# Altium project NewSmartwatch_V1_2025-02-18T12_48_20_UTC.PrjPcb
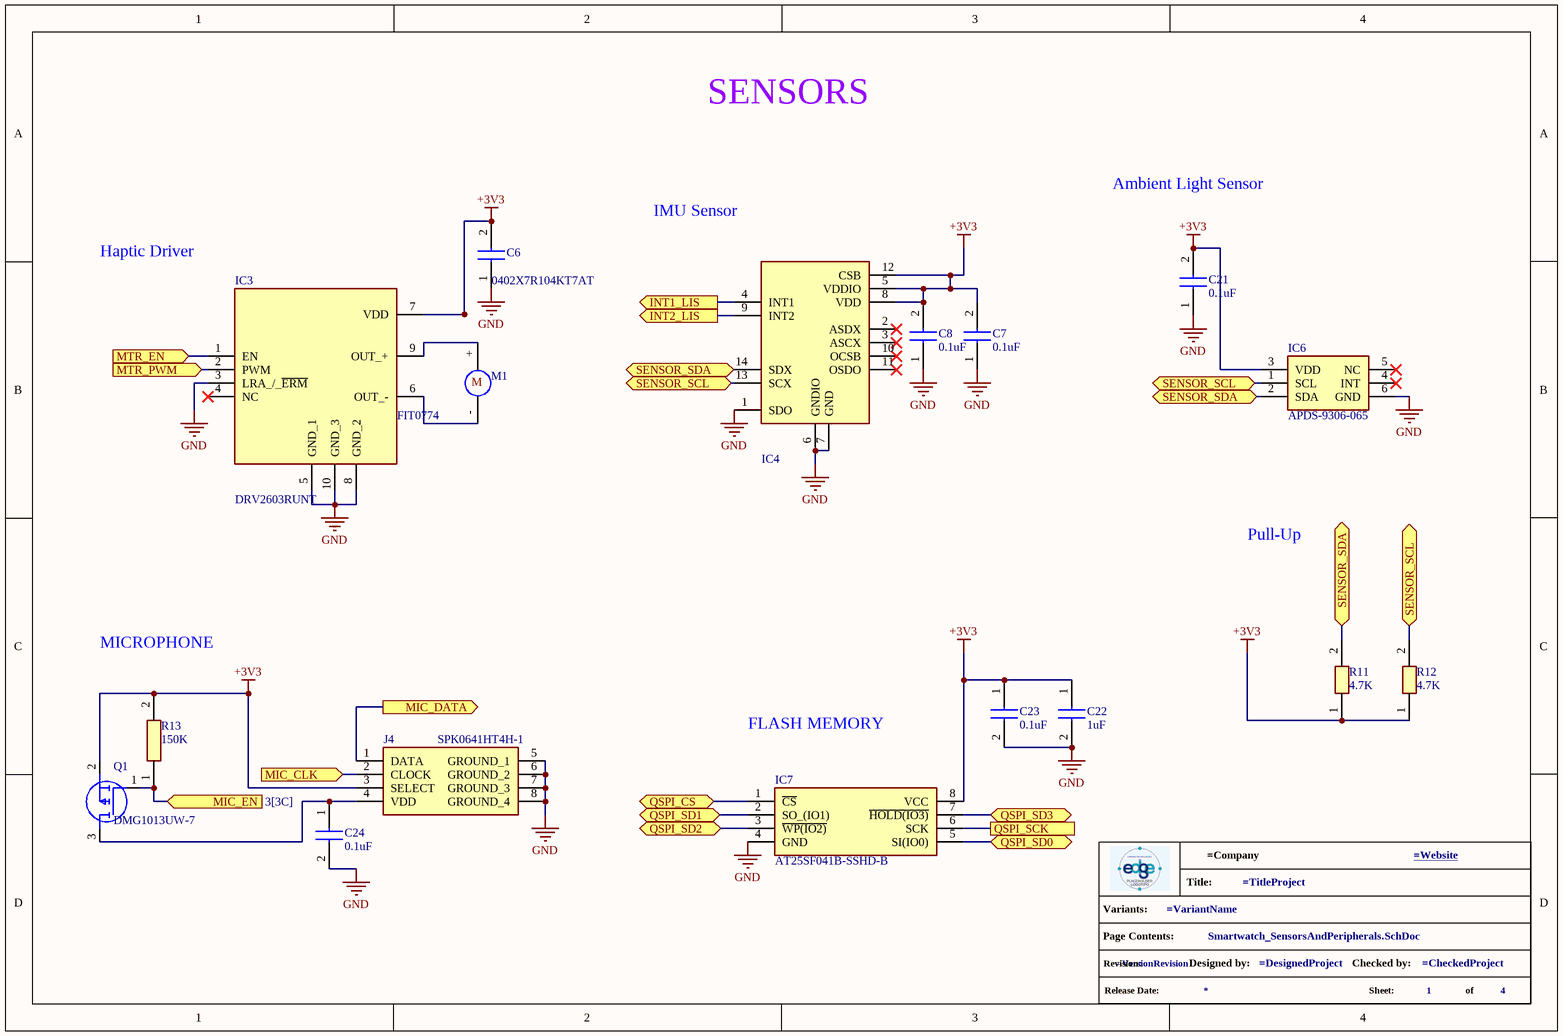
[diagram p0: Smartwatch_SensorsAndPeripherals.SchDoc]
4 sheets, 45 parts. Net scope: flat (ports and power ports of the same name join across sheets).
Board file: NewSmartwatch_V1.PcbDoc
Sheets:
  Smartwatch_SensorsAndPeripherals.SchDoc
  Smartwatch_PowerManagement.SchDoc
  Smartwatch_Microcontroller.SchDoc
  Smartwatch_Display.SchDoc

## Sheet Smartwatch_SensorsAndPeripherals.SchDoc
size A4; SheetNumber: 1; SheetTotal: 4

### Parts
(Parts that share a designator on the sheet are numbered #1, #2 ... from top to bottom, then left to right.)
*?#1  info_project  (value not drawn)  (graphical)
C6  0402X7R104KT7AT  [CAPC1005X61N]
C7  0.1uF  [CAPC1005X61N]
C8  0.1uF  [CAPC1005X61N]
C21  0.1uF  [CAPC1005X61N]
C22  1uF  [CAPC1005X65N]
C23  0.1uF  [CAPC1005X61N]
C24  0.1uF  [CAPC1005X61N]
IC3  DRV2603RUNT  [QFN50P200X200X80-10N-D]
IC4  BMI270  [BMI270]  (value not drawn)
IC6  APDS-9306-065  [APDS9306065]
IC7  AT25SF041B-SSHD-B  [SOIC127P600X175-8N]
J4  SPK0641HT4H-1  [SPK0641HT4H1]
M1  FIT0774  [FIT0774]
Q1  DMG1013UW-7  [SOT65P210X110-3N]
R11  4.7K  [ERJPA2_(0402)]
R12  4.7K  [ERJPA2_(0402)]
R13  150K  [RESC1608X55N]

### Ports
INT1_LIS (out, see 3[1C]), INT2_LIS (out, see 3[2D]), MIC_CLK (in, see 3[1D]), MIC_DATA (out, see 3[1C]), MIC_EN (in, see 3[3C]), MTR_EN (in, see 3[2C]), MTR_PWM (in, see 3[2C]), QSPI_CS (bidir, see 3[1C]), QSPI_SCK (see 3[1D]), QSPI_SD0 (bidir, see 3[1C]), QSPI_SD1 (bidir, see 3[1C]), QSPI_SD2 (bidir, see 3[1C]), QSPI_SD3 (bidir, see 3[1D]), SENSOR_SCL (bidir, see 1[2B], 1[3B], 3[1B]), SENSOR_SCL (bidir, see 1[2B], 1[4C], 3[1B]), SENSOR_SCL (bidir, see 1[3B], 1[4C], 3[1B]), SENSOR_SDA (bidir, see 1[2B], 1[3B], 3[1B]), SENSOR_SDA (bidir, see 1[2B], 1[4C], 3[1B]), SENSOR_SDA (bidir, see 1[3B], 1[4C], 3[1B])

### Nets
+3V3: C6.2 C7.2 C8.2 C21.2 C22.1 C23.1 IC3.7(VDD) IC4.5(VDDIO) IC4.8(VDD) IC4.12(CSB) IC6.3(VDD) IC7.8(VCC) J4.3(SELECT) Q1.2(S) R11.1 R12.1 R13.2
GND: C6.1 C7.1 C8.1 C21.1 C22.2 C23.2 C24.2 IC3.3(LRA_/_~{ERM}) IC3.5(GND_1) IC3.8(GND_2) IC3.10(GND_3) IC4.1(SDO) IC4.6(GNDIO) IC4.7(GND) IC6.6(GND) IC7.4(GND) J4.5(GROUND_1) J4.6(GROUND_2) J4.7(GROUND_3) J4.8(GROUND_4)
INT1_LIS: IC4.4(INT1) ; port INT1_LIS
INT2_LIS: IC4.9(INT2) ; port INT2_LIS
MIC_CLK: J4.2(CLOCK) ; port MIC_CLK
MIC_DATA: J4.1(DATA) ; port MIC_DATA
MIC_EN: Q1.1(G) R13.1 ; port MIC_EN
MTR_EN: IC3.1(EN) ; port MTR_EN
MTR_PWM: IC3.2(PWM) ; port MTR_PWM
QSPI_CS: IC7.1(~{CS}) ; port QSPI_CS
QSPI_SCK: IC7.6(SCK) ; port QSPI_SCK
QSPI_SD0: IC7.5(SI(IO0)) ; port QSPI_SD0
QSPI_SD1: IC7.2(SO_(IO1)) ; port QSPI_SD1
QSPI_SD2: IC7.3(~{WP(IO2)}) ; port QSPI_SD2
QSPI_SD3: IC7.7(~{HOLD(IO3)}) ; port QSPI_SD3
SENSOR_SCL: IC4.13(SCX) IC6.1(SCL) R12.2 ; port SENSOR_SCL
SENSOR_SDA: IC4.14(SDX) IC6.2(SDA) R11.2 ; port SENSOR_SDA
NetC24_1: C24.1 J4.4(VDD) Q1.3(D)
NetIC3_6: IC3.6(OUT_-) M1.-
NetIC3_9: IC3.9(OUT_+) M1.+

Not connected (* = marked no-connect by the designer): IC3 4(NC)*; IC4 2(ASDX)* 3(ASCX)* 10(OCSB)* 11(OSDO)*; IC6 4(INT)* 5(NC)*

### Notes on the sheet
- SENSORS
- IMU Sensor
- Ambient Light Sensor
- Haptic Driver
- Pull-Up
- MICROPHONE
- FLASH MEMORY
- (in symbol FIT0774) M
- (in symbol info_project) Title:; Variants:; Page Contents:; Revision:; Designed by:; Checked by:; Release Date:; Sheet:; of

### Library data of the parts
C6-C8 C21 C23 C24 = 0402X7R104KT7AT: Multilayer Ceramic Capacitors MLCC - SMD/SMT 16V 0.1uF X7R 10%; Manufacturer_Name: Kyocera AVX; Datasheet Link: https://www.mouser.es/datasheet/2/40/general_purpose-3169586.pdf; Height: 0.61mm; Manufacturer_Part_Number: 0402X7R104KT7AT; Mouser Part Number: 581-0402X7R104KT7AT; Mouser Price/Stock: https://www.mouser.co.uk/ProductDetail/KYOCERA-AVX/0402X7R104KT7AT?qs=DPoM0jnrROXD467pFR2ukA%3D%3D
C22 = CC0402KRX5R6BB105: Multilayer Ceramic Capacitors MLCC - SMD/SMT 10V 1uF X5R 0402 10% HI CV; Manufacturer_Name: YAGEO; Datasheet Link: https://www.yageo.com/upload/media/product/app/datasheet/mlcc/upy-gphc_x5r_4v-to-50v.pdf; Height: 0.55mm; Manufacturer_Part_Number: CC0402KRX5R6BB105; Mouser Part Number: 603-CC402KRX5R6BB105; Mouser Price/Stock: https://www.mouser.co.uk/ProductDetail/YAGEO/CC0402KRX5R6BB105?qs=BKNoF%2F0xMNu0TvpE6ze2Iw%3D%3D; Arrow Part Number: CC0402KRX5R6BB105; Arrow Price/Stock: https://www.arrow.com/en/products/cc0402krx5r6bb105/yageo?region=nac
IC3 = DRV2603RUNT: Motor / Motion / Ignition Controllers & Drivers Haptic Driver w/Auto Resonance Tracking; Manufacturer_Name: Texas Instruments; Datasheet Link: http://www.ti.com/lit/ds/symlink/drv2603.pdf; Height: 0.8mm; Manufacturer_Part_Number: DRV2603RUNT; Mouser Part Number: 595-DRV2603RUNT; Mouser Price/Stock: https://www.mouser.co.uk/ProductDetail/Texas-Instruments/DRV2603RUNT?qs=y0LsnOHuQQ66fXxKAgGo4A%3D%3D; Arrow Part Number: DRV2603RUNT; Arrow Price/Stock: https://www.arrow.com/en/products/drv2603runt/texas-instruments
IC4 = BMI270: IMUs - Inertial Measurement Units Smart Ultra-Low Power Inertial Measurement Unit (IMU) for Wearable Applications; Manufacturer_Name: BOSCH; Datasheet Link: https://www.bosch-sensortec.com/media/boschsensortec/downloads/datasheets/bst-bmi270-ds000.pdf; Height: 0.87mm; Manufacturer_Part_Number: BMI270; Mouser Part Number: 262-BMI270; Mouser Price/Stock: https://www.mouser.co.uk/ProductDetail/Bosch-Sensortec/BMI270?qs=u16ybLDytRYIj%252BjQEee88A%3D%3D; Arrow Part Number: BMI270; Arrow Price/Stock: https://www.arrow.com/en/products/bmi270/bosch?utm_currency=USD&region=nac
IC6 = APDS-9306-065: Ambient Light Sensors Digital Ambient Light Sensor; Manufacturer_Name: Avago Technologies; Datasheet Link: A19870331a; Height: 0.75mm; Manufacturer_Part_Number: APDS-9306-065; Mouser Part Number: 630-APDS-9306-065; Mouser Price/Stock: https://www.mouser.co.uk/ProductDetail/Broadcom-Avago/APDS-9306-065?qs=JUmsgfbaopRTut8Cx4p19A%3D%3D
IC7 = AT25SF041B-SSHD-B: NOR Flash 4 Mbit, 3.0V (2.5V to 3.6V), -40C to 85C, SOIC-N 150mil (Tube), Single, Dual, Quad SPI NOR Flash; Manufacturer_Name: Renesas Electronics; Datasheet Link: https://www.mouser.in/datasheet/2/698/REN_DS_AT25SF041B_190H_062022_DST_20220603_1-3076039.pdf; Height: 1.75mm; Manufacturer_Part_Number: AT25SF041B-SSHD-B; Mouser Part Number: 988-AT25SF041BSSHDB; Mouser Price/Stock: https://www.mouser.co.uk/ProductDetail/Renesas-Dialog/AT25SF041B-SSHD-B?qs=IS%252B4QmGtzzoAv7Cb4U2tFA%3D%3D
J4 = SPK0641HT4H-1: Microfones MEMS SISONIC MEMS MICROPHONE;Digital;Top;64.5dB SNR;120dB SPL;-26 +/-1dBV;35Hz;70dB PSRR;Low Power: 230 / Standard: 630;1.8V; Manufacturer_Name: Knowles Johanson Manufacturing; Datasheet Link: https://www.knowles.com/docs/default-source/model-downloads/spk0641ht4h-1-rev-a.pdf; Height: 1.1mm; Manufacturer_Part_Number: SPK0641HT4H-1; Mouser Part Number: 721-SPK0641HT4H-1; Mouser Price/Stock: https://www.mouser.com/Search/Refine.aspx?Keyword=721-SPK0641HT4H-1
M1 = FIT0774: Mini Vibration Motor (10*2.7MM); Manufacturer: DFRobot; Supplier: Mouser; Supplier Part Number: 426-FIT0774; Manufacturer Part Number: FIT0774; RoHS: No; Category: Motors and Drives; Stock: 3316; Pricing: 1=0,99, 10=0,99, 50=0,99, 100=0,99, 1000=0,99, 10000=0,99 (USD)
Q1 = DMG1013UW-7: MOSFET (P-Channel); Manufacturer_Name: Diodes Incorporated; Datasheet Link: https://www.diodes.com//assets/Datasheets/ds31861.pdf; Height: 1.1mm; Manufacturer_Part_Number: DMG1013UW-7; Mouser Part Number: 621-DMG1013UW-7; Mouser Price/Stock: https://www.mouser.co.uk/ProductDetail/Diodes-Incorporated/DMG1013UW-7?qs=GWgl%252BsiMZr9p7lJcuAyJvw%3D%3D; Arrow Part Number: DMG1013UW-7; Arrow Price/Stock: https://www.arrow.com/en/products/dmg1013uw-7/diodes-incorporated?region=nac
R11 R12 = ERJ-PA2F4701X: Thick Film Resistors - SMD 0402 1% 4.7Kohm Anti-Surge AEC-Q200; Manufacturer_Name: Panasonic; Datasheet Link: http://industrial.panasonic.com/cdbs/www-data/pdf/RDO0000/AOA0000C331.pdf; Height: 0.4mm; Manufacturer_Part_Number: ERJ-PA2F4701X; Mouser Part Number: 667-ERJ-PA2F4701X; Mouser Price/Stock: https://www.mouser.co.uk/ProductDetail/Panasonic/ERJ-PA2F4701X?qs=h9NfwcE6J0JdNXujYyUhOg%3D%3D; Arrow Part Number: ERJ-PA2F4701X; Arrow Price/Stock: https://www.arrow.com/en/products/erj-pa2f4701x/panasonic?region=nac
R13 = RK73B1JTTDD154J: Thick Film Resistors - SMD 1/10W 150K OHM 5%; Manufacturer_Name: KOA Speer; Datasheet Link: http://www.koaspeer.com/catimages/Products/RK73-RT/RK73-RT.pdf; Height: 0.55mm; Manufacturer_Part_Number: RK73B1JTTDD154J; Mouser Part Number: 660-RK73B1JTTDD154J; Mouser Price/Stock: https://www.mouser.co.uk/ProductDetail/KOA-Speer/RK73B1JTTDD154J?qs=eQc%252BYniTHCffTX8fUgD2hw%3D%3D

## Sheet Smartwatch_PowerManagement.SchDoc
size A4; SheetNumber: 2; SheetTotal: 4
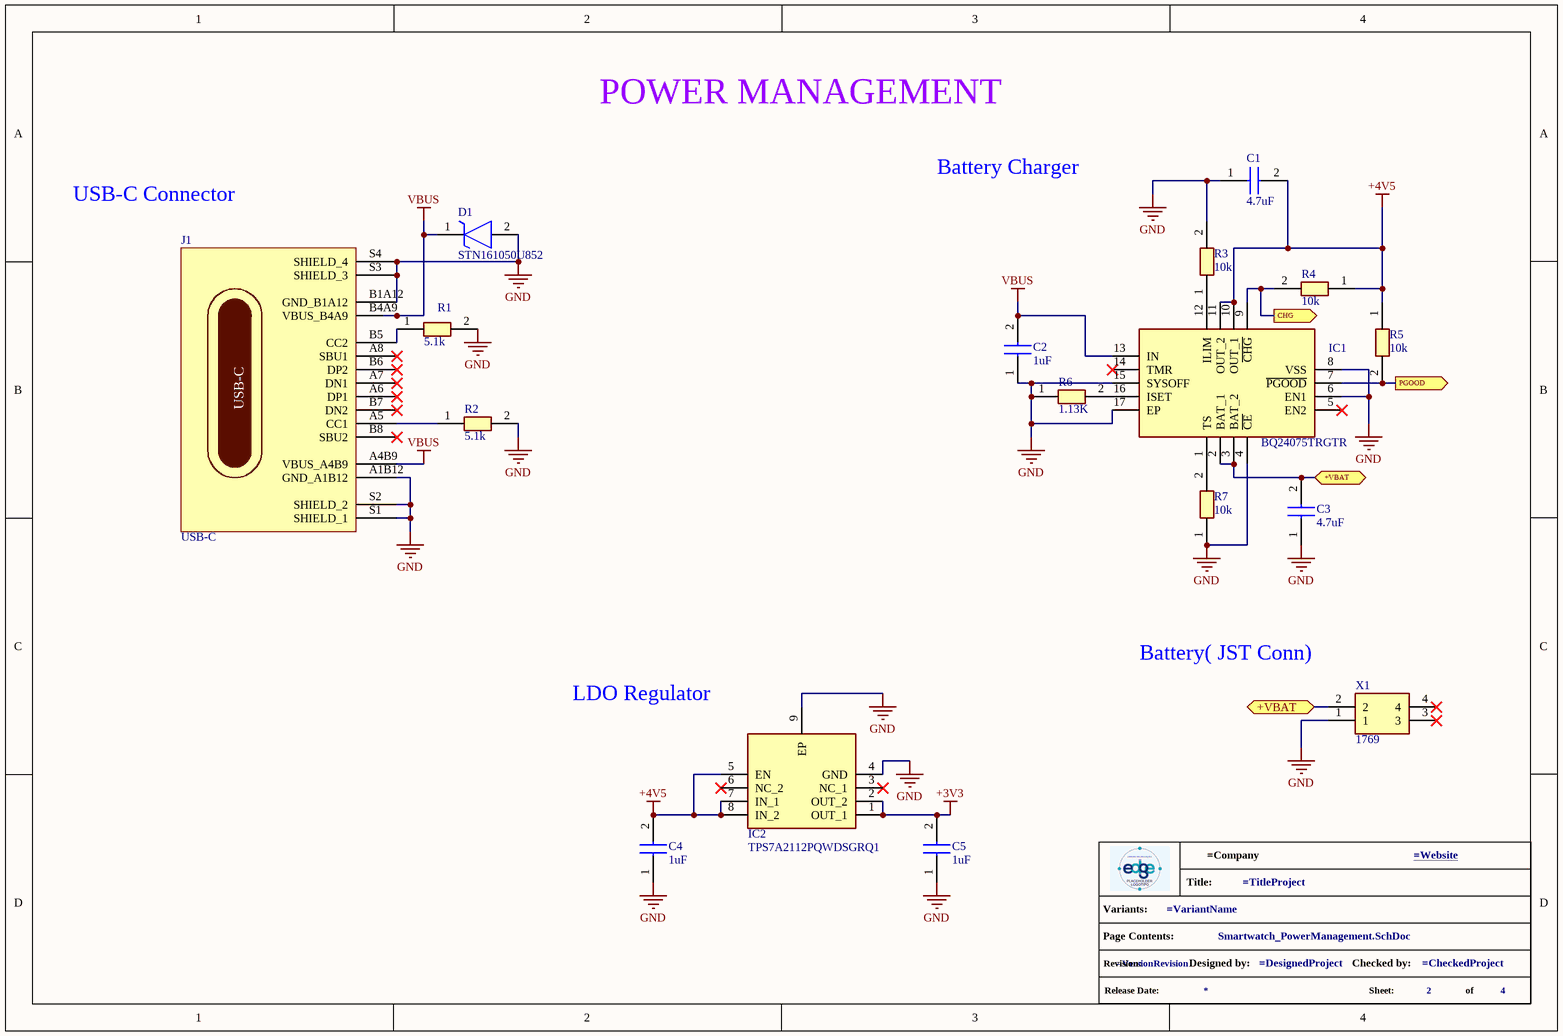
[diagram p1: Smartwatch_PowerManagement.SchDoc]

### Parts
(Parts that share a designator on the sheet are numbered #1, #2 ... from top to bottom, then left to right.)
*?#2  info_project  (value not drawn)  (graphical)
C1  4.7uF  [CAPC1005X65N]
C2  1uF  [CAPC1005X65N]
C3  4.7uF  [CAPC1005X65N]
C4  1uF  [CAPC1005X65N]
C5  1uF  [CAPC1005X65N]
D1  STN161050U852  [STN161050U852]
IC1  BQ24075TRGTR  [QFN50P300X300X100-17N-D]
IC2  TPS7A2112PQWDSGRQ1  [SON50P200X200X80-9N]
J1  USB-C  [FP-2171790001-MFG]
R1  5.1k  [RESC1005X40]
R2  5.1k  [RESC1005X40]
R3  10k  [RESC1005X37N]
R4  10k  [RESC1005X37N]
R5  10k  [RESC1005X37N]
R6  1.13K  [RESC1005X37N]
R7  10k  [RESC1005X37N]
X1  1769  [1769]

### Ports
+VBAT (bidir, see 2[4B]), +VBAT (bidir, see 2[4C]), CHG (out, see 3[1C]), PGOOD (out, see 3[1C])

### Nets
+3V3: C5.2 IC2.1(OUT_1) IC2.2(OUT_2)
+4V5: C1.2 C4.2 IC1.10(OUT_1) IC1.11(OUT_2) IC2.5(EN) IC2.7(IN_1) IC2.8(IN_2) R4.1 R5.1
GND: C1.1 C2.1 C3.1 C4.1 C5.1 D1.2(A) IC1.4(~{CE}) IC1.6(EN1) IC1.8(VSS) IC1.15(SYSOFF) IC1.17(EP) IC2.4(GND) IC2.9(EP) J1.A1B12(GND_A1B12) J1.B1A12(GND_B1A12) J1.S1(SHIELD_1) J1.S2(SHIELD_2) J1.S3(SHIELD_3) J1.S4(SHIELD_4) R1.2 R2.2 R3.2 R6.1 R7.1 X1.1
VBUS: C2.2 D1.1(K) IC1.13(IN) J1.A4B9(VBUS_A4B9) J1.B4A9(VBUS_B4A9)
+VBAT: C3.2 IC1.2(BAT_1) IC1.3(BAT_2) X1.2 ; port +VBAT
CHG: IC1.9(~{CHG}) R4.2 ; port CHG
PGOOD: IC1.7(~{PGOOD}) R5.2 ; port PGOOD
NetIC1_1: IC1.1(TS) R7.2
NetIC1_12: IC1.12(ILIM) R3.1
NetIC1_16: IC1.16(ISET) R6.2
NetJ1_A5: J1.A5(CC1) R2.1
NetJ1_B5: J1.B5(CC2) R1.1

Not connected (* = marked no-connect by the designer): IC1 5(EN2)* 14(TMR)*; IC2 3(NC_1)* 6(NC_2)*; J1 A6(DP1)* A7(DN1)* A8(SBU1)* B6(DP2)* B7(DN2)* B8(SBU2)*; X1 3* 4*

### Notes on the sheet
- POWER MANAGEMENT
- Battery Charger
- USB-C Connector
- (near IC2) LDO Regulator
- (near X1) Battery( JST Conn)
- (in symbol info_project) Title:; Variants:; Page Contents:; Revision:; Designed by:; Checked by:; Release Date:; Sheet:; of

### Library data of the parts
C1 C3 = GRM31CR61A475KA01L: Multilayer Ceramic Capacitors MLCC - SMD/SMT 4.7 uF 10 VDC 20% 0402 X5R; Manufacturer_Name: Murata Electronics; Datasheet Link: http://www.murata.com/~/media/webrenewal/support/library/catalog/products/capacitor/mlcc/c02e.pdf; Height: 1.8mm; Manufacturer_Part_Number: GRM31CR61A475KA01L; Mouser Part Number: 81-GRM426R475K10L; Mouser Price/Stock: https://www.mouser.co.uk/ProductDetail/Murata-Electronics/GRM31CR61A475KA01L?qs=v6FXEKp3YeVDfOIVbbYCqg%3D%3D; Arrow Part Number: GRM31CR61A475KA01L; Arrow Price/Stock: https://www.arrow.com/en/products/grm31cr61a475ka01l/murata-manufacturing
C2 C4 C5 = CC0402KRX5R6BB105: as C22 on sheet Smartwatch_SensorsAndPeripherals; Datasheet Link: https://www.yageo.com/upload/media/product/app/datasheet/mlcc/upy-gphc_x5r_4v-to-50v.pdf; Height: 0.55mm; Manufacturer_Part_Number: CC0402KRX5R6BB105; Mouser Part Number: 603-CC402KRX5R6BB105; Mouser Price/Stock: https://www.mouser.co.uk/ProductDetail/YAGEO/CC0402KRX5R6BB105?qs=BKNoF%2F0xMNu0TvpE6ze2Iw%3D%3D; Arrow Part Number: CC0402KRX5R6BB105; Arrow Price/Stock: https://www.arrow.com/en/products/cc0402krx5r6bb105/yageo?region=nac
D1 = STN161050U852: TVS Diode (Uni-directional); Manufacturer_Name: Eaton; Datasheet Link: https://www.digikey.com/en/products/detail/eaton-electronics-division/STN161050U852/13280470?msockid=3e3afa68a50969ca3057ef1ca4c9684b; Height: 0.55mm; Manufacturer_Part_Number: STN161050U852; Mouser Part Number: 504-STN161050U852; Mouser Price/Stock: https://www.mouser.co.uk/ProductDetail/Bussmann-Eaton/STN161050U852?qs=DPoM0jnrROX%2FlbVCTeWaTw%3D%3D
IC1 = BQ24075TRGTR: Gerenciadores de bateria 1.5A USB-Friendly Li Ion Batt Charger; Manufacturer_Name: Texas Instruments; Datasheet Link: http://componentsearchengine.com/Datasheets/1/BQ24075TRGTR.pdf; Height: 1mm; Manufacturer_Part_Number: BQ24075TRGTR; Mouser Part Number: 595-BQ24075TRGTR; Mouser Price/Stock: https://www.mouser.co.uk/ProductDetail/Texas-Instruments/BQ24075TRGTR?qs=%2Fqzd9s%252BcLd4uxZAT5jNskQ%3D%3D; Arrow Part Number: BQ24075TRGTR; Arrow Price/Stock: https://www.arrow.com/en/products/bq24075trgtr/texas-instruments?region=nac
IC2 = TPS7A2112PQWDSGRQ1: LDO Voltage Regulators Automotive, 500mA, low-noise ultra-low-IQ high-PSRR low-dropout (LDO) voltage regulator; Manufacturer_Name: Texas Instruments; Datasheet Link: https://www.ti.com/lit/gpn/tps7a21-q1; Height: 0.8mm; Manufacturer_Part_Number: TPS7A2112PQWDSGRQ1
J1 = 217179-0001: USB Connector, 16 Contact(s), Female, Right Angle, Surface Mount Terminal, Locking, Receptacle; Manufacturer: Molex; Supplier: Mouser; Supplier Part Number: 538-217179-0001; Manufacturer Part Number: 217179-0001; RoHS: No; Category: USB Connectors; Stock: 4841; Pricing: 1=0,9, 10=0,745, 50=0,745, 100=0,622, 1000=0,622, 10000=0,446 (USD)
R1 R2 = ERJ-2RHD512X: Fixed Resistor, Metal Glaze/thick Film, 0.063W, 5110ohm, 50V, 0.5% +/-Tol, 50ppm/Cel, Surface Mount, 0402; Manufacturer: Panasonic; Manufacturer Series: ERJ2R; Power: 63mW; Rated Temperature: 70°C; Value: 5.11kR; Temperature Coefficient: 50ppm/°C; Supplier: Mouser; Supplier Part Number: 667-ERJ-2RHD512X; Manufacturer Part Number: ERJ-2RHD512X; RoHS: Yes; Stock: 18329; Pricing: 1=0,13, 10=0,11, 50=0,11, 100=0,043, 1000=0,019, 10000=0,019 (USD); Mounting Technology: Surface Mount; Pins: 2; Package Shape: Rectangular; Case/Package: 0402; Terminal Finish: Tin; Min Operating Temperature: -55°C; Max Operating Temperature: 125°C; Tolerance: 0.5%; JESD-609 Code: e3; Resistor Type: FIXED RESISTOR; Packaging: Tape and Reel; Technology: METAL GLAZE/THICK FILM; Termination: Wraparound; Working Voltage: 50V; Reach SVHC Compliant: Yes; RoHS Compliant: Yes; ComponentLink1URL: https://datasheet.ciiva.com:443/pdfs/VipMasterCap/Capacitor/PANA/PANAS11022/PANAS11022-1.pdf?src-supplier=IHS+Markit; ComponentLink1Description: https://datasheet.ciiva.com:443/pdfs/VipMasterCap/Capacitor/PANA/PANAS11022/PANAS11022-1.pdf?src-supplier=IHS+Markit; ComponentLink2URL: https://datasheet.ciiva.com/24037/aoa0000ce2-24037669.pdf?src-supplier=Mouser; ComponentLink2Description: https://datasheet.ciiva.com/24037/aoa0000ce2-24037669.pdf?src-supplier=Mouser
R3-R5 R7 = MCS0402MD1002BE100: Resistores de Filme Fino - SMD .063W 10Kohms 0.1% 0402 25ppm Auto; Manufacturer_Name: Vishay; Datasheet Link: http://www.vishay.com/docs/28705/mcx0x0xpro.pdf; Height: 0.37mm; Manufacturer_Part_Number: MCS0402MD1002BE100; Mouser Part Number: 594-MCS0402MD1002BE1; Mouser Price/Stock: https://www.mouser.co.uk/ProductDetail/Vishay-Beyschlag/MCS0402MD1002BE100?qs=3SvaY9RawMIFge2HspqWnA%3D%3D; Arrow Part Number: MCS0402MD1002BE100; Arrow Price/Stock: https://www.arrow.com/en/products/mcs0402md1002be100/vishay?region=nac
R6 = AF0402FR-071K13L: Fixed Resistor, Metal Glaze/thick Film, 0.0625W, 1130ohm, 50V, 1% +/-Tol, 100ppm/Cel, Surface Mount, 0402; Manufacturer: Yageo; Additional Feature: ANTI-SULFUR; Power: 62.5mW; Rated Temperature: 70°C; Value: 1.13kR; Temperature Coefficient: 100ppm/°C; Package Height: 0.32mm; Package Length: 1mm; Package Width: 0.5mm; Reference Standard: AEC-Q200; Supplier: Mouser; Supplier Part Number: 603-AF0402FR-071K13L; Manufacturer Part Number: AF0402FR-071K13L; RoHS: Yes; Category: Chip SMD Resistors; Stock: 3100; Pricing: 1=0,15, 10=0,037, 50=0,037, 100=0,02, 1000=0,012, 10000=0,006 (USD); Mounting Technology: Surface Mount; Pins: 2; Case/Package: 0402; Min Operating Temperature: -55°C; Max Operating Temperature: 155°C; Tolerance: 1%; Resistor Type: FIXED RESISTOR; Construction: Rectangular; Package Style: SMTMeter; Packaging: Tape and Reel; Termination: Wraparound; Working Voltage: 50V; Reach SVHC Compliant: Yes; RoHS Compliant: Yes; ComponentLink1URL: https://datasheet.ciiva.com:443/pdfs/VipMasterIC/IC/YAGO/YAGO-S-A0009016998/YAGO-S-A0009016998-1.pdf?src-supplier=IHS+Markit; ComponentLink1Description: https://datasheet.ciiva.com:443/pdfs/VipMasterIC/IC/YAGO/YAGO-S-A0009016998/YAGO-S-A0009016998-1.pdf?src-supplier=IHS+Markit; ComponentLink2URL: https://www.yageo.com/upload/media/product/productsearch/datasheet/rchip/PYu-AF_51_RoHS_L_6.pdf?src-supplier=Digikey; ComponentLink2Description: https://www.yageo.com/upload/media/product/productsearch/datasheet/rchip/PYu-AF_51_RoHS_L_6.pdf?src-supplier=Digikey
X1 = 1769: Adafruit Accessories JST-PH 2-pin SMT Right Angle Connect; Datasheet Link: https://cdn-shop.adafruit.com/datasheets/17311.pdf; Height: 5.5mm; Manufacturer_Name: Adafruit; Manufacturer_Part_Number: 1769; Mouser Part Number: 485-1769; Mouser Price/Stock: https://www.mouser.co.uk/ProductDetail/Adafruit/1769?qs=GURawfaeGuBbgoGtf2XstA%3D%3D; Arrow Part Number: 1769; Arrow Price/Stock: https://www.arrow.com/en/products/1769/adafruit-industries?utm_currency=USD&region=nac

## Sheet Smartwatch_Microcontroller.SchDoc
size A4; SheetNumber: 3; SheetTotal: 4
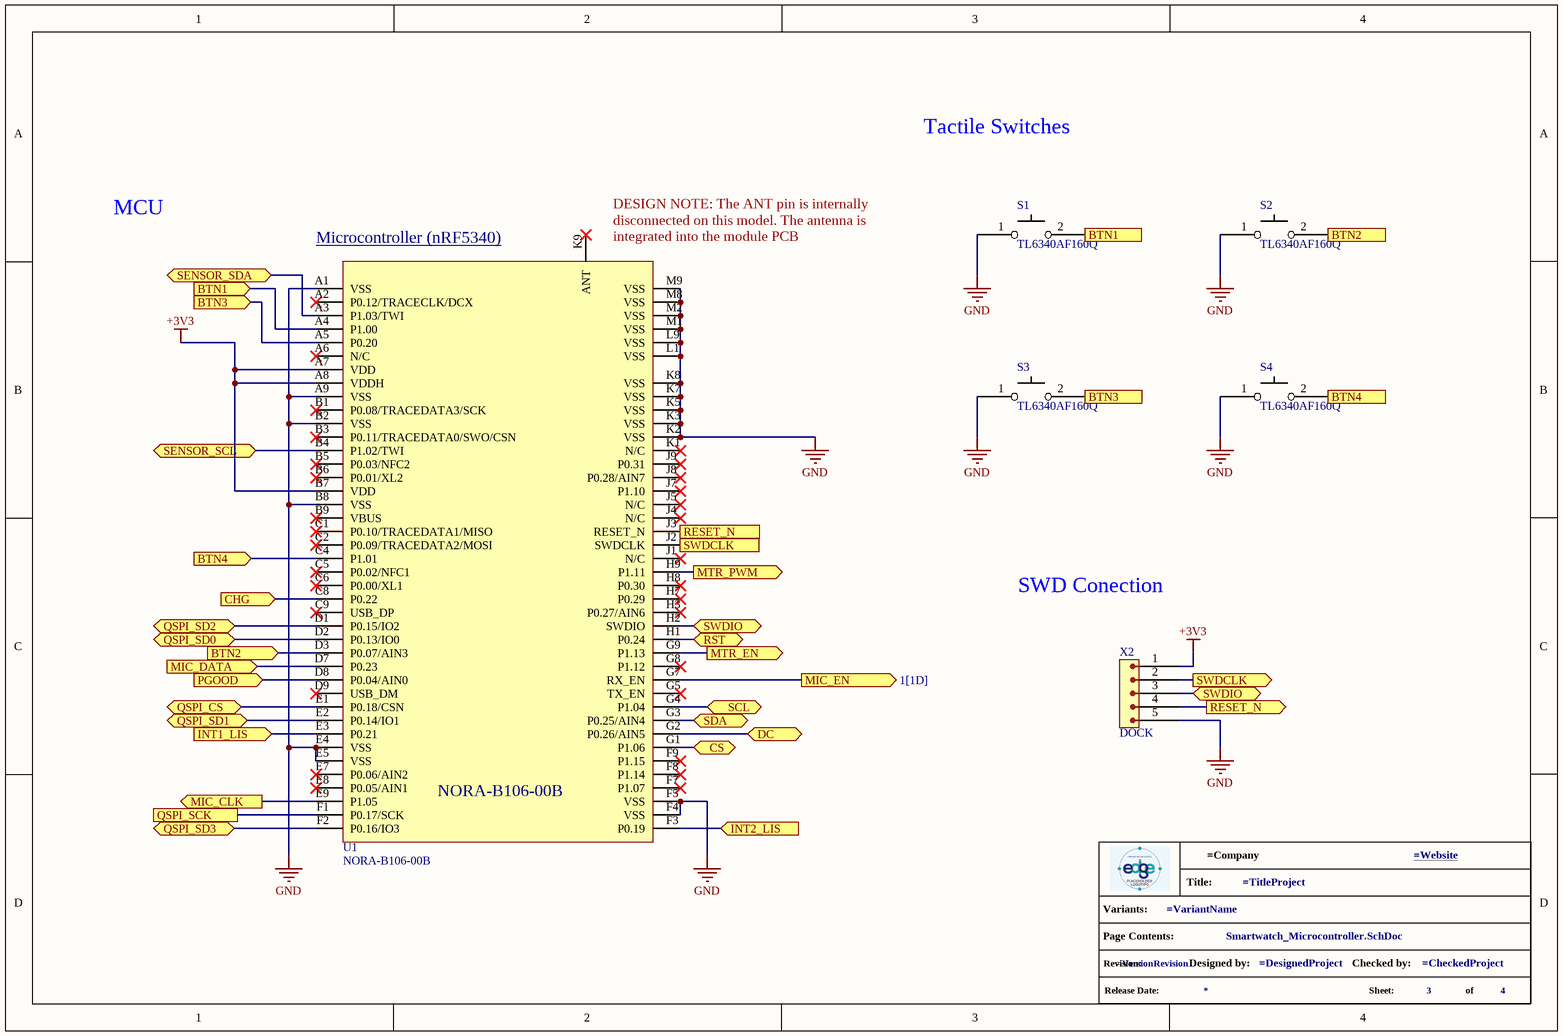
[diagram p2: Smartwatch_Microcontroller.SchDoc]

### Parts
(Parts that share a designator on the sheet are numbered #1, #2 ... from top to bottom, then left to right.)
*?#3  info_project  (value not drawn)  (graphical)
S1  TL6340AF160Q  [SW_TL6340AF160Q]
S2  TL6340AF160Q  [SW_TL6340AF160Q]
S3  TL6340AF160Q  [SW_TL6340AF160Q]
S4  TL6340AF160Q  [SW_TL6340AF160Q]
U1  NORA-B106-00B  [XCVR_NORA-B106-00B]
X2  DOCK  [SAMTEC_FTSH-105-XX-X-DV]

### Ports
BTN1 (in, see 3[3A]), BTN1 (out, see 3[1B]), BTN2 (in, see 3[4A]), BTN2 (out, see 3[1C]), BTN3 (in, see 3[3B]), BTN3 (out, see 3[1B]), BTN4 (in, see 3[4B]), BTN4 (out, see 3[1C]), CHG (in, see 2[4B]), CS (bidir, see 4[1B]), DC (bidir, see 4[1B]), INT1_LIS (in, see 1[2B]), INT2_LIS (in, see 1[2B]), MIC_CLK (out, see 1[1D]), MIC_DATA (in, see 1[1C]), MIC_EN (out, see 1[1D]), MTR_EN (out, see 1[1B]), MTR_PWM (out, see 1[1B]), PGOOD (in, see 2[4B]), QSPI_CS (bidir, see 1[2D]), QSPI_SCK (see 1[3D]), QSPI_SD0 (bidir, see 1[3D]), QSPI_SD1 (bidir, see 1[2D]), QSPI_SD2 (bidir, see 1[2D]), QSPI_SD3 (bidir, see 1[3D]), RESET_N (in, see 3[4C]), RESET_N (out, see 3[2C]), RST (bidir, see 4[1B]), SCL (bidir, see 4[1B]), SDA (bidir, see 4[1B]), SENSOR_SCL (bidir, see 1[2B], 1[3B], 1[4C]), SENSOR_SDA (bidir, see 1[2B], 1[3B], 1[4C]), SWDCLK (in, see 3[4C]), SWDCLK (out, see 3[2C]), SWDIO (bidir, see 3[2C]), SWDIO (bidir, see 3[4C])

### Nets
+3V3: U1.A7(VDD) U1.A8(VDDH) U1.B7(VDD) X2.1
GND: S1.1 S2.1 S3.1 S4.1 U1.A1(VSS) U1.A9(VSS) U1.B2(VSS) U1.B8(VSS) U1.E4(VSS) U1.E5(VSS) U1.F4(VSS) U1.F5(VSS) U1.K2(VSS) U1.K3(VSS) U1.K5(VSS) U1.K7(VSS) U1.K8(VSS) U1.L1(VSS) U1.L9(VSS) U1.M1(VSS) U1.M2(VSS) U1.M8(VSS) U1.M9(VSS) X2.5
BTN1: S1.2 U1.A4(P1.00) ; port BTN1
BTN2: S2.2 U1.D3(P0.07/AIN3) ; port BTN2
BTN3: S3.2 U1.A5(P0.20) ; port BTN3
BTN4: S4.2 U1.C4(P1.01) ; port BTN4
CHG: U1.C8(P0.22) ; port CHG
CS: U1.G1(P1.06) ; port CS
DC: U1.G2(P0.26/AIN5) ; port DC
INT1_LIS: U1.E3(P0.21) ; port INT1_LIS
INT2_LIS: U1.F3(P0.19) ; port INT2_LIS
MIC_CLK: U1.E9(P1.05) ; port MIC_CLK
MIC_DATA: U1.D7(P0.23) ; port MIC_DATA
MIC_EN: U1.G7(RX_EN) ; port MIC_EN
MTR_EN: U1.G9(P1.13) ; port MTR_EN
MTR_PWM: U1.H9(P1.11) ; port MTR_PWM
PGOOD: U1.D8(P0.04/AIN0) ; port PGOOD
QSPI_CS: U1.E1(P0.18/CSN) ; port QSPI_CS
QSPI_SCK: U1.F1(P0.17/SCK) ; port QSPI_SCK
QSPI_SD0: U1.D2(P0.13/IO0) ; port QSPI_SD0
QSPI_SD1: U1.E2(P0.14/IO1) ; port QSPI_SD1
QSPI_SD2: U1.D1(P0.15/IO2) ; port QSPI_SD2
QSPI_SD3: U1.F2(P0.16/IO3) ; port QSPI_SD3
RESET_N: U1.J3(RESET_N) X2.4 ; port RESET_N
RST: U1.H1(P0.24) ; port RST
SCL: U1.G4(P1.04) ; port SCL
SDA: U1.G3(P0.25/AIN4) ; port SDA
SENSOR_SCL: U1.B4(P1.02/TWI) ; port SENSOR_SCL
SENSOR_SDA: U1.A3(P1.03/TWI) ; port SENSOR_SDA
SWDCLK: U1.J2(SWDCLK) X2.2 ; port SWDCLK
SWDIO: U1.H2(SWDIO) X2.3 ; port SWDIO

Not connected (* = marked no-connect by the designer): U1 A2(P0.12/TRACECLK/DCX)* A6(N/C)* B1(P0.08/TRACEDATA3/SCK)* B3(P0.11/TRACEDATA0/SWO/CSN)* B5(P0.03/NFC2)* B6(P0.01/XL2)* B9(VBUS)* C1(P0.10/TRACEDATA1/MISO)* C2(P0.09/TRACEDATA2/MOSI)* C5(P0.02/NFC1)* C6(P0.00/XL1)* C9(USB_DP)* D9(USB_DM)* E7(P0.06/AIN2)* E8(P0.05/AIN1)* F7(P1.07)* F8(P1.14)* F9(P1.15)* G5(TX_EN)* G8(P1.12)* H3(P0.27/AIN6)* H7(P0.29)* H8(P0.30)* J1(N/C)* J4(N/C)* J5(N/C)* J7(P1.10)* J8(P0.28/AIN7)* J9(P0.31)* K1(N/C)* K9(ANT)*

### Notes on the sheet
- Tactile Switches
- MCU
- (near U1) Microcontroller (nRF5340) <https://br.mouser.com/datasheet/2/1025/NORA_B1_DataSheet_UBX_20027119-3180474.pdf>
- (near U1) DESIGN NOTE: The ANT pin is internally disconnected on this model. The antenna is integrated into the module PCB
- SWD Conection
- (in symbol info_project) Title:; Variants:; Page Contents:; Revision:; Designed by:; Checked by:; Release Date:; Sheet:; of

### Library data of the parts
S1-S4 = TL6340AF160Q: Keypad Switch, 1 Switches, SPST, Momentary-tactile, 0.02A, 12VDC, 1.57N, 2 PCB Hole Cnt, Solder Terminal, Surface Mount-right Angle; Manufacturer: E-Switch; Supplier: Mouser; Supplier Part Number: 612-TL6340AF160QG; Manufacturer Part Number: TL6340AF160Q; RoHS: Yes; Category: Tactile Switches; Stock: 2006; Pricing: 1=0,51, 10=0,478, 50=0,478, 100=0,377, 1000=0,313, 10000=0,255 (USD); ComponentLink1URL: https://datasheet.octopart.com/TL6340AF160Q-E-Switch-datasheet-155697155.pdf?src-supplier=Future+Electronics; ComponentLink1Description: https://datasheet.octopart.com/TL6340AF160Q-E-Switch-datasheet-155697155.pdf?src-supplier=Future+Electronics; ComponentLink2URL: https://datasheet.octopart.com/TL6340AF160Q-E-Switch-datasheet-165860010.pdf?src-supplier=TME; ComponentLink2Description: https://datasheet.octopart.com/TL6340AF160Q-E-Switch-datasheet-165860010.pdf?src-supplier=TME
U1 = NORA-B106-00B: Bluetooth Modules - 802.15.1 nRF5340, PCB antenna, open CPU; Manufacturer: u-blox; Supplier: Mouser; Supplier Part Number: 377-NORA-B106-00B; Manufacturer Part Number: NORA-B106-00B; RoHS: No; Category: LDO; Stock: 4440; Pricing: 1=14, 10=12,74, 50=11,72, 100=10,9, 1000=10,9, 10000=10,9 (USD); ComponentLink1URL: https://datasheet.octopart.com/NORA-B106-00B-u-blox-datasheet-166811452.pdf?src-supplier=TME; ComponentLink1Description: https://datasheet.octopart.com/NORA-B106-00B-u-blox-datasheet-166811452.pdf?src-supplier=TME
X2 = 4048: Mini SWD 0.05 Pitch Connector - 10 Pin SMT Box Header | Adafruit Industries 4048; Supplier: Mouser; Supplier Part Number: 485-4048; Manufacturer: Adafruit Industries; Manufacturer Part Number: 4048; RoHS: No; Category: Connectors; Stock: 723; Pricing: 1=1,95, 10=1,95, 50=1,95, 100=1,95, 1000=1,95, 10000=1,95 (USD); ComponentLink1URL: https://media.digikey.com/pdf/Data%20Sheets/Adafruit%20PDFs/4048_Web.pdf?src-supplier=Digikey; ComponentLink1Description: https://media.digikey.com/pdf/Data%20Sheets/Adafruit%20PDFs/4048_Web.pdf?src-supplier=Digikey

## Sheet Smartwatch_Display.SchDoc
size A4; SheetNumber: 4; SheetTotal: 4
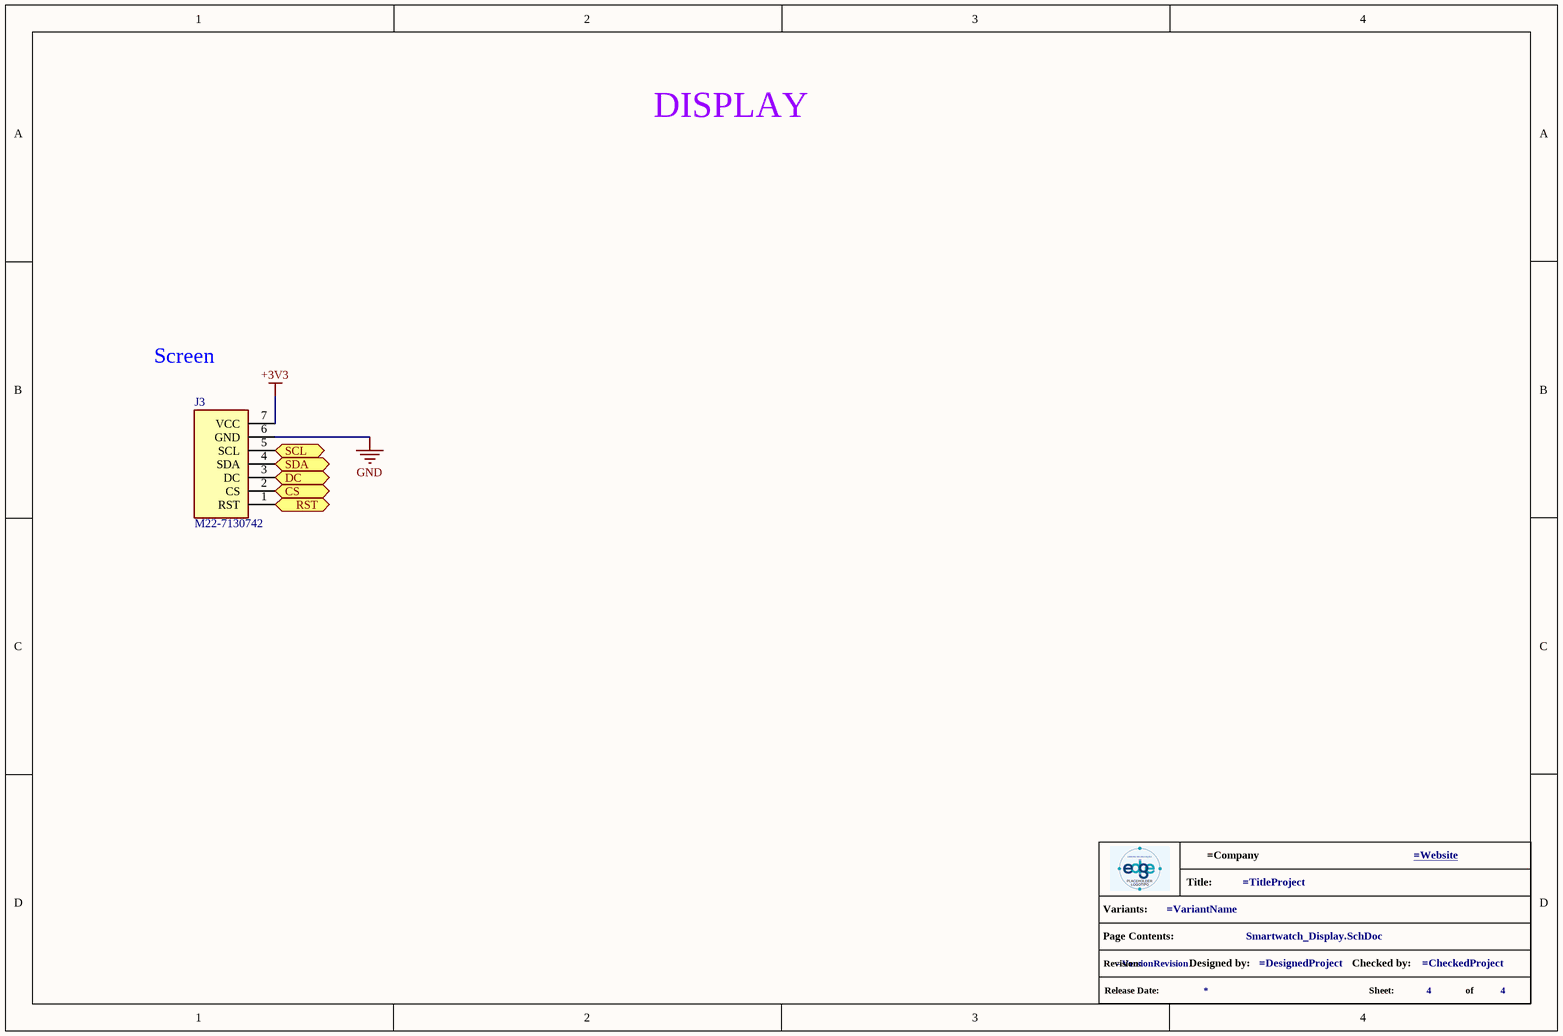
[diagram p3: Smartwatch_Display.SchDoc]

### Parts
(Parts that share a designator on the sheet are numbered #1, #2 ... from top to bottom, then left to right.)
*?#4  info_project  (value not drawn)  (graphical)
J3  M22-7130742  [SHDR7W50P0X200_1X7_1450X240X440P]

### Ports
CS (bidir, see 3[2C]), DC (bidir, see 3[2C]), RST (bidir, see 3[2C]), SCL (bidir, see 3[2C]), SDA (bidir, see 3[2C])

### Nets
+3V3: J3.7(VCC)
GND: J3.6(GND)
CS: J3.2(CS) ; port CS
DC: J3.3(DC) ; port DC
RST: J3.1(RST) ; port RST
SCL: J3.5(SCL) ; port SCL
SDA: J3.4(SDA) ; port SDA

### Notes on the sheet
- DISPLAY
- Screen
- (in symbol info_project) Title:; Variants:; Page Contents:; Revision:; Designed by:; Checked by:; Release Date:; Sheet:; of

### Library data of the parts
J3 = M22-7130742: Connector; Manufacturer_Name: Harwin; Datasheet Link: https://cdn.harwin.com/pdfs/M22-713.pdf; Height: 4.4mm; Manufacturer_Part_Number: M22-7130742; Mouser Part Number: 855-M22-7130742; Mouser Price/Stock: https://www.mouser.co.uk/ProductDetail/Harwin/M22-7130742?qs=ulE8k0yEMYatGybRLMpABg%3D%3D

## Nets that join several sheets
+3V3: Smartwatch_SensorsAndPeripherals (17 pins), Smartwatch_PowerManagement (C5.2 IC2.1 IC2.2), Smartwatch_Microcontroller (U1.A7 U1.A8 U1.B7 X2.1), Smartwatch_Display (J3.7)
GND: Smartwatch_SensorsAndPeripherals (20 pins), Smartwatch_PowerManagement (25 pins), Smartwatch_Microcontroller (24 pins), Smartwatch_Display (J3.6)
CHG: Smartwatch_PowerManagement (IC1.9 R4.2), Smartwatch_Microcontroller (U1.C8)
CS: Smartwatch_Microcontroller (U1.G1), Smartwatch_Display (J3.2)
DC: Smartwatch_Microcontroller (U1.G2), Smartwatch_Display (J3.3)
INT1_LIS: Smartwatch_SensorsAndPeripherals (IC4.4), Smartwatch_Microcontroller (U1.E3)
INT2_LIS: Smartwatch_SensorsAndPeripherals (IC4.9), Smartwatch_Microcontroller (U1.F3)
MIC_CLK: Smartwatch_SensorsAndPeripherals (J4.2), Smartwatch_Microcontroller (U1.E9)
MIC_DATA: Smartwatch_SensorsAndPeripherals (J4.1), Smartwatch_Microcontroller (U1.D7)
MIC_EN: Smartwatch_SensorsAndPeripherals (Q1.1 R13.1), Smartwatch_Microcontroller (U1.G7)
MTR_EN: Smartwatch_SensorsAndPeripherals (IC3.1), Smartwatch_Microcontroller (U1.G9)
MTR_PWM: Smartwatch_SensorsAndPeripherals (IC3.2), Smartwatch_Microcontroller (U1.H9)
PGOOD: Smartwatch_PowerManagement (IC1.7 R5.2), Smartwatch_Microcontroller (U1.D8)
QSPI_CS: Smartwatch_SensorsAndPeripherals (IC7.1), Smartwatch_Microcontroller (U1.E1)
QSPI_SCK: Smartwatch_SensorsAndPeripherals (IC7.6), Smartwatch_Microcontroller (U1.F1)
QSPI_SD0: Smartwatch_SensorsAndPeripherals (IC7.5), Smartwatch_Microcontroller (U1.D2)
QSPI_SD1: Smartwatch_SensorsAndPeripherals (IC7.2), Smartwatch_Microcontroller (U1.E2)
QSPI_SD2: Smartwatch_SensorsAndPeripherals (IC7.3), Smartwatch_Microcontroller (U1.D1)
QSPI_SD3: Smartwatch_SensorsAndPeripherals (IC7.7), Smartwatch_Microcontroller (U1.F2)
RST: Smartwatch_Microcontroller (U1.H1), Smartwatch_Display (J3.1)
SCL: Smartwatch_Microcontroller (U1.G4), Smartwatch_Display (J3.5)
SDA: Smartwatch_Microcontroller (U1.G3), Smartwatch_Display (J3.4)
SENSOR_SCL: Smartwatch_SensorsAndPeripherals (IC4.13 IC6.1 R12.2), Smartwatch_Microcontroller (U1.B4)
SENSOR_SDA: Smartwatch_SensorsAndPeripherals (IC4.14 IC6.2 R11.2), Smartwatch_Microcontroller (U1.A3)

## Assembly variants
Prototype: all parts fitted
RoundScreen: all parts fitted